# Altium schematic sheet in3ator.SchDoc: Main
size A3; Date: 17/09/18; Author: Pablo Sánchez Bergasa; Revision: 2.A.1; SheetNumber: 1; SheetTotal: 9; DocumentName: Main
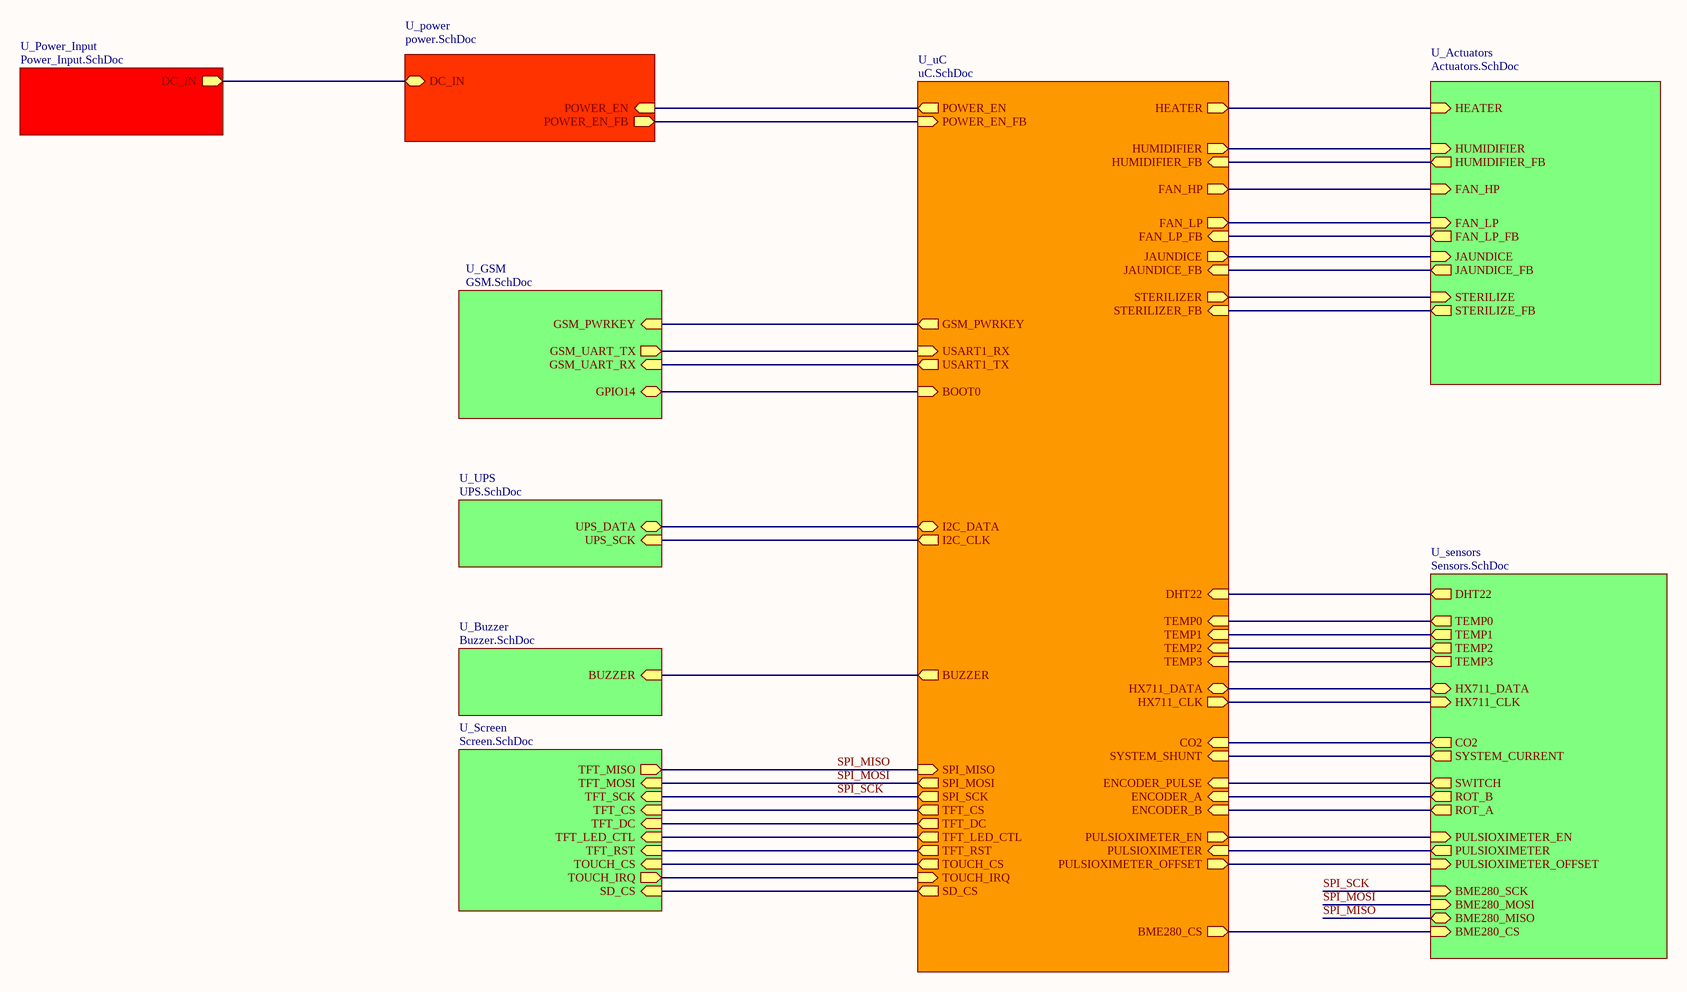
[diagram p0: in3ator.SchDoc]

## Sub-sheets
U_Actuators = Actuators.SchDoc: HEATER (in), FAN_HP (in), FAN_LP (in), FAN_LP_FB (out), HUMIDIFIER (in), HUMIDIFIER_FB (out), JAUNDICE (in), JAUNDICE_FB (out), STERILIZE (in), STERILIZE_FB (out)
U_Buzzer = Buzzer.SchDoc: BUZZER (in)
U_GSM = GSM.SchDoc: GSM_UART_TX (out), GSM_UART_RX (in), GSM_PWRKEY (in), GPIO14
U_power = power.SchDoc: POWER_EN_FB (out), POWER_EN (in), DC_IN
U_Power_Input = Power_Input.SchDoc: DC_IN
U_Screen = Screen.SchDoc: SD_CS (in), TFT_CS (in), TOUCH_CS (in), TOUCH_IRQ (out), TFT_RST (in), TFT_DC (in), TFT_MOSI (in), TFT_MISO, TFT_LED_CTL (in), TFT_SCK (in)
U_sensors = Sensors.SchDoc: SYSTEM_CURRENT (out), CO2 (out), DHT22 (out), HX711_DATA (bidir), SWITCH (out), ROT_B (out), ROT_A (out), TEMP0 (out), TEMP2 (out), TEMP3 (out), TEMP1 (out), HX711_CLK (in), PULSIOXIMETER (out), PULSIOXIMETER_OFFSET (in), BME280_CS (in), BME280_MISO, BME280_MOSI (in), BME280_SCK (in), PULSIOXIMETER_EN (in)
U_uC = uC.SchDoc: HUMIDIFIER_FB (in), SYSTEM_SHUNT (in), HEATER (out), JAUNDICE_FB (in), STERILIZER_FB (in), BUZZER (out), JAUNDICE (out), CO2 (in), HUMIDIFIER (out), DHT22 (in), STERILIZER (out), POWER_EN_FB (in), POWER_EN (out), FAN_LP (out), BOOT0 (in), FAN_HP (out), I2C_DATA (bidir), I2C_CLK (out), FAN_LP_FB (in), BME280_CS (out), SPI_MISO, SPI_SCK (out), SPI_MOSI (out), TOUCH_IRQ (in), TFT_DC (out), TFT_CS (out), TFT_RST (out), TOUCH_CS (out), SD_CS (out), TFT_LED_CTL (out), GSM_PWRKEY (out), USART1_RX (in), USART1_TX (out), HX711_CLK (out), HX711_DATA (bidir), TEMP0 (in), TEMP1 (in), TEMP2 (in), TEMP3 (in), ENCODER_PULSE (in), ENCODER_A (in), ENCODER_B (in), PULSIOXIMETER (in), PULSIOXIMETER_OFFSET (out), PULSIOXIMETER_EN (out)
U_UPS = UPS.SchDoc: UPS_DATA (bidir), UPS_SCK (in)

## Nets
SPI_MISO: sheet U_sensors/BME280_MISO, sheet U_uC/SPI_MISO, sheet U_Screen/TFT_MISO
SPI_MOSI: sheet U_sensors/BME280_MOSI, sheet U_uC/SPI_MOSI, sheet U_Screen/TFT_MOSI
SPI_SCK: sheet U_sensors/BME280_SCK, sheet U_uC/SPI_SCK, sheet U_Screen/TFT_SCK
(unnamed): sheet U_power/POWER_EN_FB, sheet U_uC/POWER_EN_FB
(unnamed): sheet U_power/POWER_EN, sheet U_uC/POWER_EN
(unnamed): sheet U_power/DC_IN, sheet U_Power_Input/DC_IN
(unnamed): sheet U_GSM/GSM_UART_TX, sheet U_uC/USART1_RX
(unnamed): sheet U_GSM/GSM_UART_RX, sheet U_uC/USART1_TX
(unnamed): sheet U_GSM/GSM_PWRKEY, sheet U_uC/GSM_PWRKEY
(unnamed): sheet U_GSM/GPIO14, sheet U_uC/BOOT0
(unnamed): sheet U_sensors/SYSTEM_CURRENT, sheet U_uC/SYSTEM_SHUNT
(unnamed): sheet U_sensors/CO2, sheet U_uC/CO2
(unnamed): sheet U_sensors/DHT22, sheet U_uC/DHT22
(unnamed): sheet U_sensors/HX711_DATA, sheet U_uC/HX711_DATA
(unnamed): sheet U_sensors/SWITCH, sheet U_uC/ENCODER_PULSE
(unnamed): sheet U_sensors/ROT_B, sheet U_uC/ENCODER_A
(unnamed): sheet U_sensors/ROT_A, sheet U_uC/ENCODER_B
(unnamed): sheet U_sensors/TEMP0, sheet U_uC/TEMP0
(unnamed): sheet U_sensors/TEMP2, sheet U_uC/TEMP2
(unnamed): sheet U_sensors/TEMP3, sheet U_uC/TEMP3
(unnamed): sheet U_sensors/TEMP1, sheet U_uC/TEMP1
(unnamed): sheet U_sensors/HX711_CLK, sheet U_uC/HX711_CLK
(unnamed): sheet U_sensors/PULSIOXIMETER, sheet U_uC/PULSIOXIMETER
(unnamed): sheet U_sensors/PULSIOXIMETER_OFFSET, sheet U_uC/PULSIOXIMETER_OFFSET
(unnamed): sheet U_sensors/BME280_CS, sheet U_uC/BME280_CS
(unnamed): sheet U_sensors/PULSIOXIMETER_EN, sheet U_uC/PULSIOXIMETER_EN
(unnamed): sheet U_uC/HUMIDIFIER_FB, sheet U_Actuators/HUMIDIFIER_FB
(unnamed): sheet U_uC/HEATER, sheet U_Actuators/HEATER
(unnamed): sheet U_uC/JAUNDICE_FB, sheet U_Actuators/JAUNDICE_FB
(unnamed): sheet U_uC/STERILIZER_FB, sheet U_Actuators/STERILIZE_FB
(unnamed): sheet U_uC/BUZZER, sheet U_Buzzer/BUZZER
(unnamed): sheet U_uC/JAUNDICE, sheet U_Actuators/JAUNDICE
(unnamed): sheet U_uC/HUMIDIFIER, sheet U_Actuators/HUMIDIFIER
(unnamed): sheet U_uC/STERILIZER, sheet U_Actuators/STERILIZE
(unnamed): sheet U_uC/FAN_LP, sheet U_Actuators/FAN_LP
(unnamed): sheet U_uC/FAN_HP, sheet U_Actuators/FAN_HP
(unnamed): sheet U_uC/I2C_DATA, sheet U_UPS/UPS_DATA
(unnamed): sheet U_uC/I2C_CLK, sheet U_UPS/UPS_SCK
(unnamed): sheet U_uC/FAN_LP_FB, sheet U_Actuators/FAN_LP_FB
(unnamed): sheet U_uC/TOUCH_IRQ, sheet U_Screen/TOUCH_IRQ
(unnamed): sheet U_uC/TFT_DC, sheet U_Screen/TFT_DC
(unnamed): sheet U_uC/TFT_CS, sheet U_Screen/TFT_CS
(unnamed): sheet U_uC/TFT_RST, sheet U_Screen/TFT_RST
(unnamed): sheet U_uC/TOUCH_CS, sheet U_Screen/TOUCH_CS
(unnamed): sheet U_uC/SD_CS, sheet U_Screen/SD_CS
(unnamed): sheet U_uC/TFT_LED_CTL, sheet U_Screen/TFT_LED_CTL

## Notes on the sheet
- Title
- Size:
- Date:
- A3
- Author:
- Time:
- Revision:
- Sheet
- of
- File: